# Altium project ESC.PrjPcb
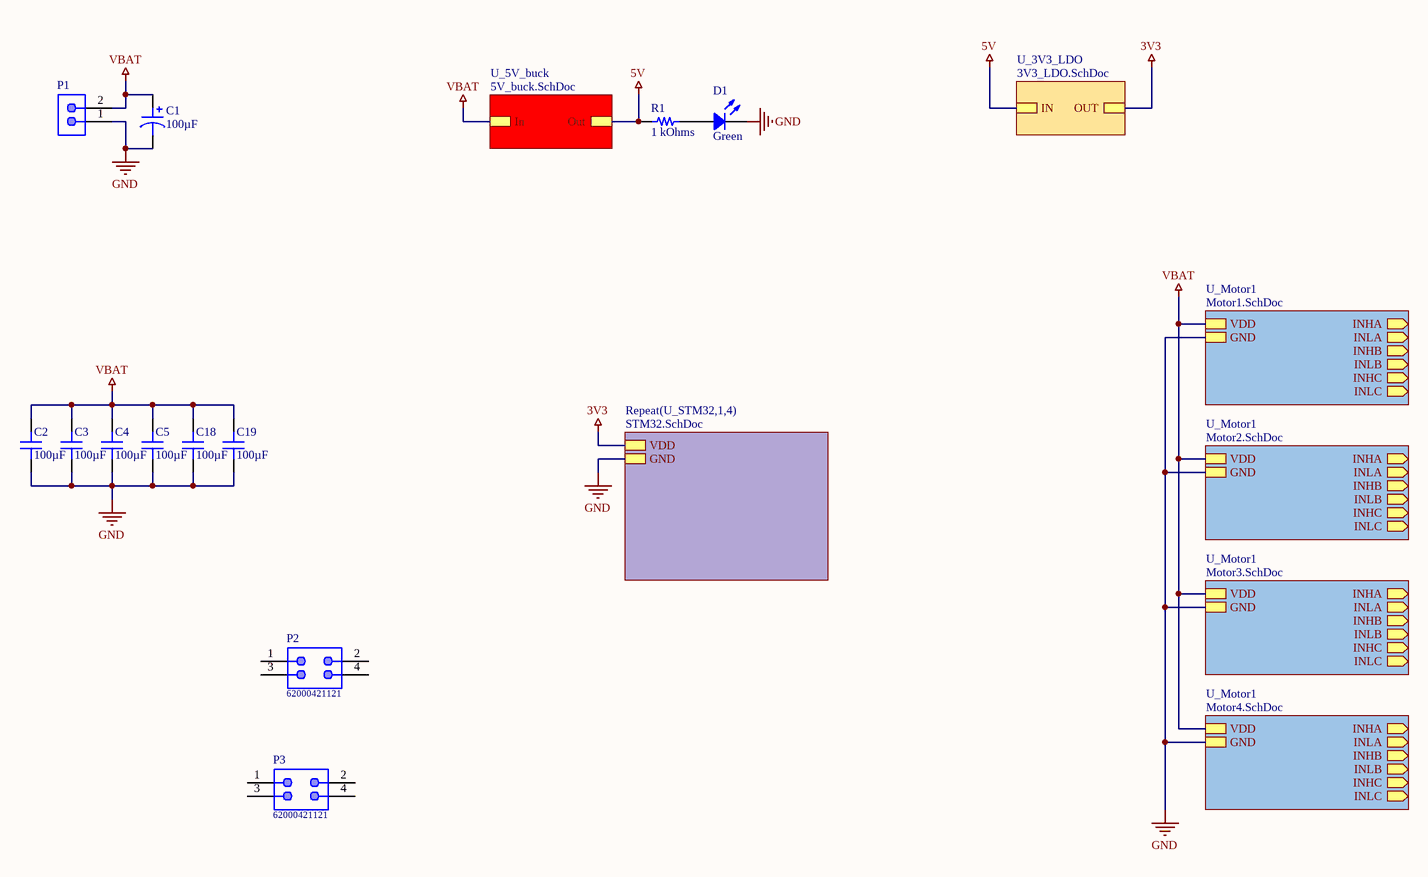
[diagram p0: Top.SchDoc]
8 sheets, 138 parts. Net scope: hierarchical (ports join the sheet entries above them; power ports are global).
Board file: ESC.PcbDoc
Sheets:
  Top.SchDoc
    U_5V_buck = 5V_buck.SchDoc
    U_3V3_LDO = 3V3_LDO.SchDoc
    U_Motor1 = Motor1.SchDoc
    U_Motor1 = Motor2.SchDoc
    U_Motor1 = Motor3.SchDoc
    U_Motor1 = Motor4.SchDoc
    U_STM321 = STM32.SchDoc
    U_STM322 = STM32.SchDoc
    U_STM323 = STM32.SchDoc
    U_STM324 = STM32.SchDoc

## Sheet Top.SchDoc
size B; SheetNumber: 1; SheetTotal: 8

### Parts
C1  100µF  [CAP POL 2917_7343]
C2  100µF  [CAP 1210_3225 - 2.8MM]
C3  100µF  [CAP 1210_3225 - 2.8MM]
C4  100µF  [CAP 1210_3225 - 2.8MM]
C5  100µF  [CAP 1210_3225 - 2.8MM]
C18  100µF  [CAP 1210_3225 - 2.8MM]
C19  100µF  [CAP 1210_3225 - 2.8MM]
D1  Green  [LED 0603_1608 GREEN]
P1  2 pin 2mm JST Male  [2pin - 2mm JST male]  (value not drawn)
P2  62000421121  [62000421121]
P3  62000421121  [62000421121]
R1  1 kOhms  [RES 0603_1608]

### Sub-sheets
Repeat(U_STM32,1,4) = STM32.SchDoc: VDD, GND
U_3V3_LDO = 3V3_LDO.SchDoc: OUT, IN
U_5V_buck = 5V_buck.SchDoc: Out, In
U_Motor1 = Motor1.SchDoc: VDD, GND, INHA (out), INLA (out), INHB (out), INLB (out), INHC (out), INLC (out)
U_Motor1 = Motor2.SchDoc: VDD, GND, INHA (out), INLA (out), INHB (out), INLB (out), INHC (out), INLC (out)
U_Motor1 = Motor3.SchDoc: VDD, GND, INHA (out), INLA (out), INHB (out), INLB (out), INHC (out), INLC (out)
U_Motor1 = Motor4.SchDoc: VDD, GND, INHA (out), INLA (out), INHB (out), INLB (out), INHC (out), INLC (out)

### Nets
3V3: sheet U_3V3_LDO/OUT, sheet Repeat(U_STM32,1,4)/VDD
5V: R1.1 ; sheet U_5V_buck/Out, sheet U_3V3_LDO/IN
GND: C1.2 C2.1 C3.1 C4.1 C5.1 C18.1 C19.1 D1.2 P1.1 ; sheet U_Motor1/GND, sheet U_Motor1/GND, sheet U_Motor1/GND, sheet U_Motor1/GND, sheet Repeat(U_STM32,1,4)/GND
VBAT: C1.1 C2.2 C3.2 C4.2 C5.2 C18.2 C19.2 P1.2 ; sheet U_5V_buck/In, sheet U_Motor1/VDD, sheet U_Motor1/VDD, sheet U_Motor1/VDD, sheet U_Motor1/VDD
NetD1_1: D1.1 R1.2

Not connected (* = marked no-connect by the designer): P2 1 2 3 4; P3 1 2 3 4

### Library data of the parts
C1 = 293D107X0020E2TE3: CAP TANT 100UF 20% 20V 2917; Manufacturer: Vishay Sprague; Manufacturer Size Code: E; ESR (Equivalent Series Resistance): 500mOhm; Type: Molded; Part Number: 293D107X0020E2TE3; Value: 100µF; Capacitance: 100µF; ComponentLink1Description: Datasheet; ComponentLink1URL: http://www.vishay.com/docs/40002/293d.pdf; ComponentLink2Description: DigiKey Link; ComponentLink2URL: http://digikey.com/product-detail/en/vishay-sprague/293D107X0020E2TE3/718-293D107X0020E2TE3CT-ND/10507022; Device Package: 2917 (7343 Metric); Features: General Purpose; Height - Seated (Max): 0.170" (4.32mm); LastUpdated: 13-Aug-20 10:43:35 AM; Lifecycle Status: Active; Minimum Order: 1; Mounting Type: Surface Mount; Operating Temperature: -55°C ~ 125°C; Package / Case: 2917 (7343 Metric); Packaging: TapeAndReel; PartId: 1360; Part Status: Active; Price: 0.70; Series: TANTAMOUNT®, 293D; Size / Dimension: 0.287" L x 0.169" W (7.30mm x 4.30mm); Supplier 1: DigiKey; Supplier Part Number 1: 718-293D107X0020E2TE3CT-ND; Tolerance: ±20%
C2-C5 C18 C19 = 12106D107MAT4A: CAP CER 100UF 6.3V X5R 1210; manufacturer: AVX Corporation; Tolerance: ±20%; Part Number: 12106D107MAT4A; Value: 100µF; Applications: General Purpose; Capacitance: 100µF; componentlink1description: Datasheet; componentlink1url: http://datasheets.avx.com/cx5r.pdf; componentlink2description: DigiKey Link; componentlink2url: http://digikey.com/product-detail/en/avx-corporation/12106D107MAT4A/478-11528-1-ND/8107729; Device Package: 1210 (3225 Metric); lastupdated: 9/2/2020 1:10:51 AM; Lifecycle Status: Active; Minimum Order: 1; Mounting Type: Surface Mount, MLCC; Operating Temperature: -55°C ~ 85°C; Package / Case: 1210 (3225 Metric); packaging: TapeAndReel; partid: 23954; Part Status: Active; price: 0.33; series: -; Size / Dimension: 0.126" L x 0.098" W (3.20mm x 2.50mm); Supplier 1: DigiKey; Supplier Part Number 1: 478-11528-1-ND; Temperature Coefficient: X5R; Thickness (Max): 0.110" (2.79mm); Voltage - Rated: 6.3V
D1 = XZCDGK53W-8VF: 1.6X0.8MM LC GREEN PIXSOLED DOME; Manufacturer: SunLED; Configuration: Independent; Current - Test: 2mA; Lens Color: Colorless; Lens Size: 0.35mm Dia; Lens Style: Round with Domed Top; Lens Transparency: Clear; Millicandela Rating: 417mcd; Viewing Angle: 60°; Voltage - Forward (Vf) (Typ): 2.65V; Wavelength - Dominant: 525nm; Wavelength - Peak: 515nm; Part Number: XZCDGK53W-8VF; Color: Green; ComponentLink1Description: Datasheet; ComponentLink1URL: https://www.sunledusa.com/products/spec/XZCDGK53W-8VF.pdf; ComponentLink2Description: DigiKey Link; ComponentLink2URL: http://digikey.com/product-detail/en/sunled/XZCDGK53W-8VF/1497-XZCDGK53W-8VFCT-ND/10449792; Device Package: 0603 (1608 Metric); Height (Max): 1.10mm; LastUpdated: 21-Jan-20 3:12:09 AM; Lifecycle Status: Active; Minimum Order: 1; Mounting Type: Surface Mount; Package / Case: 0603 (1608 Metric); Packaging: Unknown; PartId: 938; Part Status: Active; Price: 0.18; Series: Ultra Low Current; Size / Dimension: 1.60mm L x 0.80mm W; Supplier 1: DigiKey; Supplier Part Number 1: 1497-XZCDGK53W-8VFCT-ND; Supplier Device Package: 2-SMD; Value: Green
P2 P3 = 62000421121: WR-PHD Pin Header, THT, pitch 2mm, Dual Row, Vertical, 4p; Manufacturer: Wurth Elektronik; Pin Number: 4; Rated Current: 2A; Working Voltage: 200VAC; Withstanding Voltage: 500VAC; Contact Resistance: 20mOhm; ComponentLink1Description: Manufacturer; ComponentLink1URL: http://www.we-online.de; ComponentLink2Description: Datasheet; ComponentLink2URL: https://www.we-online.com/catalog/datasheet/62000421121.pdf; Operating Temperature: -40 to +105degC; Published Date: May 2020; Pitch: 2mm; Manufacturer Part Number: 62000421121; Mounting Technology: THT; Packaging: Bag; Gender: Pin Header; Row Number: Dual; Orientation: Vertical
R1 = RNCF0603DTE1K00: RES 1K OHM 0.5% 1/10W 0603; Manufacturer: Stackpole Electronics Inc; Power (Watts): 0.1W, 1/10W; Temperature Coefficient: ±25ppm/°C; Part Number: RNCF0603DTE1K00; Value: 1 kOhms; ComponentLink1Description: Datasheet; ComponentLink1URL: https://www.seielect.com/catalog/sei-rncf.pdf; ComponentLink2Description: DigiKey Link; ComponentLink2URL: http://digikey.com/product-detail/en/stackpole-electronics-inc/RNCF0603DTE1K00/RNCF0603DTE1K00CT-ND/9915086; Composition: Thin Film; Device Package: 0603 (1608 Metric); Features: Automotive AEC-Q200; Height - Seated (Max): 0.022" (0.55mm); LastUpdated: 21-Jan-20 12:14:28 AM; Lifecycle Status: Active; Minimum Order: 1; Number of Terminations: 2; Operating Temperature: -55°C ~ 155°C; Package / Case: 0603 (1608 Metric); Packaging: TapeAndReel; PartId: 26300; Part Status: Active; Price: 0.05; Ratings: AEC-Q200; Resistance: 1 kOhms; Series: RNCF; Size / Dimension: 0.061" L x 0.031" W (1.55mm x 0.80mm); Supplier 1: DigiKey; Supplier Part Number 1: RNCF0603DTE1K00CT-ND; Supplier Device Package: 0603; Tolerance: ±0.5%

## Sheet 5V_buck.SchDoc
size A; SheetNumber: 3; SheetTotal: 7
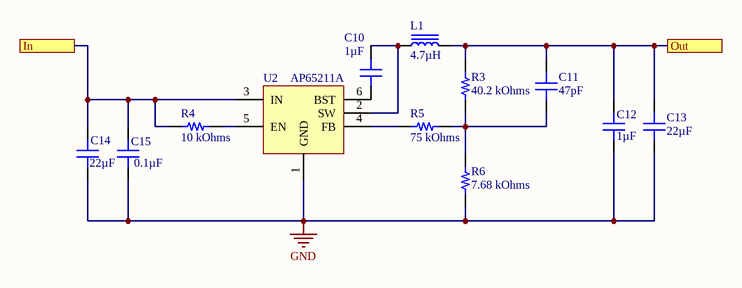
[diagram p1: 5V_buck.SchDoc]

### Parts
C10  1µF  [CAP 0603_1608]
C11  47pF  [CAP 0603_1608]
C12  1µF  [CAP 0603_1608]
C13  22µF  [CAP 0805_2012]
C14  22µF  [CAP 0805_2012]
C15  0.1µF  [CAP 0603_1608]
L1  4.7µH  [IND 1008_2520]
R3  40.2 kOhms  [RES 0603_1608]
R4  10 kOhms  [RES 0603_1608]
R5  75 kOhms  [RES 0603_1608]
R6  7.68 kOhms  [RES 0603_1608]
U2  AP65211A  [TSOT-26-6]

### Ports
In, Out

### Nets
5V: C11.2 C12.2 C13.2 L1.2 R3.2 ; port Out
GND: C12.1 C13.1 C14.1 C15.2 R6.1 U2.1(GND)
VBAT: C14.2 C15.1 R4.2 U2.3(IN) ; port In
NetC10_1: C10.1 L1.1 U2.2(SW)
NetC10_2: C10.2 U2.6(BST)
NetC11_1: C11.1 R3.1 R5.2 R6.2
NetR4_1: R4.1 U2.5(EN)
NetR5_1: R5.1 U2.4(FB)

### Library data of the parts
C10 C12 = GCJ188R71E105KA01D: CAP CER 1UF 25V X7R 0603; Manufacturer: Murata Electronics; Tolerance: ±10%; Part Number: GCJ188R71E105KA01D; Value: 1µF; Applications: Automotive, Boardflex Sensitive; Capacitance: 1µF; ComponentLink1Description: Datasheet; ComponentLink1URL: https://search.murata.co.jp/Ceramy/image/img/A01X/G101/ENG/GCJ188R71E105KA01-01.pdf; ComponentLink2Description: DigiKey Link; ComponentLink2URL: http://digikey.com/product-detail/en/murata-electronics/GCJ188R71E105KA01D/490-14409-1-ND/6606870; Device Package: 0603 (1608 Metric); Features: Soft Termination; LastUpdated: 13-Aug-20 10:24:06 AM; Lifecycle Status: Active; Minimum Order: 1; Mounting Type: Surface Mount, MLCC; Operating Temperature: -55°C ~ 125°C; Package / Case: 0603 (1608 Metric); Packaging: TapeAndReel; PartId: 9566; Part Status: Active; Price: 0.05; Ratings: AEC-Q200; Series: GCJ; Size / Dimension: 0.063" L x 0.031" W (1.60mm x 0.80mm); Supplier 1: DigiKey; Supplier Part Number 1: 490-14409-1-ND; Temperature Coefficient: X7R; Thickness (Max): 0.035" (0.90mm)
C11 = C1608NP02A470J080AA: CAP CER 47PF 100V NP0 0603; Manufacturer: TDK Corporation; Temperature Coefficient: C0G, NP0; Tolerance: ±5%; Part Number: C1608NP02A470J080AA; Value: 47pF; Applications: General Purpose; Capacitance: 47pF; ComponentLink1Description: Datasheet; ComponentLink1URL: https://product.tdk.com/info/en/catalog/datasheets/mlcc_commercial_hightemp_en.pdf?ref_disty=digikey; ComponentLink2Description: DigiKey Link; ComponentLink2URL: http://digikey.com/product-detail/en/tdk-corporation/C1608NP02A470J080AA/445-14125-1-ND/3955791; Device Package: 0603 (1608 Metric); Features: High Temperature; LastUpdated: 13-Aug-20 10:25:18 AM; Lifecycle Status: Active; Minimum Order: 1; Mounting Type: Surface Mount, MLCC; Operating Temperature: -55°C ~ 150°C; Package / Case: 0603 (1608 Metric); Packaging: TapeAndReel; PartId: 7049; Part Status: Active; Price: 0.04; Series: C; Size / Dimension: 0.063" L x 0.031" W (1.60mm x 0.80mm); Supplier 1: DigiKey; Supplier Part Number 1: 445-14125-1-ND; Thickness (Max): 0.035" (0.90mm)
C13 = CL21A226MOQNNNE: CAP CER 22UF 16V X5R 0805; Manufacturer: Samsung Electro-Mechanics; Tolerance: ±20%; Part Number: CL21A226MOQNNNE; Value: 22µF; Applications: General Purpose; Capacitance: 22µF; ComponentLink1Description: Datasheet; ComponentLink1URL: http://www.samsungsem.com/kr/support/product-search/mlcc/CL21A226MOQNNNE.jsp; ComponentLink2Description: DigiKey Link; ComponentLink2URL: http://digikey.com/product-detail/en/samsung-electro-mechanics/CL21A226MOQNNNE/1276-2909-1-ND/3890995; Device Package: 0805 (2012 Metric); LastUpdated: 21-Jan-20 12:03:05 AM; Lifecycle Status: Active; Minimum Order: 1; Mounting Type: Surface Mount, MLCC; Operating Temperature: -55°C ~ 85°C; Package / Case: 0805 (2012 Metric); Packaging: TapeAndReel; PartId: 3052; Part Status: Active; Price: 0.11; Series: CL; Size / Dimension: 0.079" L x 0.049" W (2.00mm x 1.25mm); Supplier 1: DigiKey; Supplier Part Number 1: 1276-2909-1-ND; Temperature Coefficient: X5R; Thickness (Max): 0.055" (1.40mm); Voltage - Rated: 16V
C14 = C2012X7S1E106K125AC: CAP CER 10UF 25V X7S 0805; Manufacturer: TDK Corporation; Capacitance: 10µF; Tolerance: ±10%; Part Number: C2012X7S1E106K125AC; Value: 22µF; Applications: General Purpose; ComponentLink1Description: Datasheet; ComponentLink1URL: https://product.tdk.com/en/search/capacitor/ceramic/mlcc/info?part_no=C2012X7S1E106K125AC?ref_disty=digikey; ComponentLink2Description: DigiKey Link; ComponentLink2URL: http://digikey.com/product-detail/en/tdk-corporation/C2012X7S1E106K125AC/445-181600-1-ND/9991478; Device Package: 0805 (2012 Metric); Features: Low ESL; LastUpdated: 21-Jan-20 12:03:04 AM; Lifecycle Status: Active; Minimum Order: 1; Mounting Type: Surface Mount, MLCC; Operating Temperature: -55°C ~ 125°C; Package / Case: 0805 (2012 Metric); Packaging: TapeAndReel; PartId: 3339; Part Status: Active; Price: 0.15; Series: C; Size / Dimension: 0.079" L x 0.049" W (2.00mm x 1.25mm); Supplier 1: DigiKey; Supplier Part Number 1: 445-181600-1-ND; Temperature Coefficient: X7S; Thickness (Max): 0.057" (1.45mm); Voltage - Rated: 25V
C15 = GCG188R92A104KA03D: CAP CER 0.1UF 100V 0603 EPOXY; Manufacturer: Murata Electronics; Temperature Coefficient: X8R; Tolerance: ±10%; Part Number: GCG188R92A104KA03D; Value: 0.1µF; Applications: Automotive; Capacitance: 0.1µF; ComponentLink1Description: Datasheet; ComponentLink1URL: https://search.murata.co.jp/Ceramy/image/img/A01X/G101/ENG/GCG188R92A104KA03-01.pdf; ComponentLink2Description: DigiKey Link; ComponentLink2URL: http://digikey.com/product-detail/en/murata-electronics/GCG188R92A104KA03D/490-18197-1-ND/9867926; Device Package: 0603 (1608 Metric); Features: Epoxy Mountable; LastUpdated: 21-Jan-20 12:01:59 AM; Lifecycle Status: Active; Minimum Order: 1; Mounting Type: Surface Mount, MLCC, Epoxy; Operating Temperature: -55°C ~ 150°C; Package / Case: 0603 (1608 Metric); Packaging: TapeAndReel; PartId: 9025; Part Status: Active; Price: 0.07; Ratings: AEC-Q200; Series: GCG; Size / Dimension: 0.063" L x 0.031" W (1.60mm x 0.80mm); Supplier 1: DigiKey; Supplier Part Number 1: 490-18197-1-ND; Thickness (Max): 0.035" (0.90mm); Voltage - Rated: 100V
L1 = MLP2520S4R7ST0S1: FIXED IND 4.7UH 1A 110 MOHM SMD; Manufacturer: TDK Corporation; DC Resistance (DCR): 143mOhm Max; Inductance Frequency - Test: 2MHz; Material - Core: Ferrite; Shielding: Shielded; Tolerance: ±20%; Type: Multilayer; Part Number: MLP2520S4R7ST0S1; ComponentLink1Description: Datasheet; ComponentLink1URL: https://product.tdk.com/info/en/catalog/datasheets/inductor_commercial_power_mlp2520_en.pdf?ref_disty=digikey; ComponentLink2Description: DigiKey Link; ComponentLink2URL: http://digikey.com/product-detail/en/tdk-corporation/MLP2520S4R7ST0S1/445-6378-1-ND/2465705; Current Rating (Amps): 1A; Device Package: 1008 (2520 Metric); Height - Seated (Max): 0.039" (1.00mm); Inductance: 4.7µH; LastUpdated: 13-Aug-20 11:03:40 AM; Lifecycle Status: Active; Minimum Order: 1; Mounting Type: Surface Mount; Operating Temperature: -40°C ~ 125°C; Package / Case: 1008 (2520 Metric); Packaging: TapeAndReel; PartId: 3467; Part Status: Active; Price: 0.14; Series: MLP; Size / Dimension: 0.098" L x 0.079" W (2.50mm x 2.00mm); Supplier 1: DigiKey; Supplier Part Number 1: 445-6378-1-ND; Supplier Device Package: 1008 (2520 Metric); Value: 4.7µH
R3 = RT0603DRD0740K2L: RES SMD 40.2KOHM 0.5% 1/10W 0603; Manufacturer: Yageo; Power (Watts): 0.1W, 1/10W; Temperature Coefficient: ±25ppm/°C; Part Number: RT0603DRD0740K2L; Value: 40.2 kOhms; ComponentLink1Description: Datasheet; ComponentLink1URL: https://www.yageo.com/upload/media/product/productsearch/datasheet/rchip/PYu-RT_1-to-0.01_RoHS_L_11.pdf; ComponentLink2Description: DigiKey Link; ComponentLink2URL: http://digikey.com/product-detail/en/yageo/RT0603DRD0740K2L/311-40.2KDCT-ND/1035817; Composition: Thin Film; Device Package: 0603 (1608 Metric); Height - Seated (Max): 0.022" (0.55mm); LastUpdated: 13-Aug-20 10:36:48 AM; Lifecycle Status: Active; Minimum Order: 1; Number of Terminations: 2; Operating Temperature: -55°C ~ 155°C; Package / Case: 0603 (1608 Metric); Packaging: TapeAndReel; PartId: 18076; Part Status: Active; Price: 0.02; Resistance: 40.2 kOhms; Series: RT; Size / Dimension: 0.063" L x 0.031" W (1.60mm x 0.80mm); Supplier 1: DigiKey; Supplier Part Number 1: 311-40.2KDCT-ND; Supplier Device Package: 0603; Tolerance: ±0.5%
R4 = RNCS0603BKE10K0: RES 10K OHM 0.1% 1/16W 0603; Manufacturer: Stackpole Electronics Inc; Power (Watts): 0.063W, 1/16W; Temperature Coefficient: ±25ppm/°C; Part Number: RNCS0603BKE10K0; Value: 10 kOhms; ComponentLink1Description: Datasheet; ComponentLink1URL: https://www.seielect.com/catalog/sei-rncs_rnch.pdf; ComponentLink2Description: DigiKey Link; ComponentLink2URL: http://digikey.com/product-detail/en/stackpole-electronics-inc/RNCS0603BKE10K0/RNCS0603BKE10K0CT-ND/1800113; Composition: Thin Film; Device Package: 0603 (1608 Metric); Features: Anti-Corrosive, Automotive AEC-Q200, Moisture Resistant; Height - Seated (Max): 0.022" (0.55mm); LastUpdated: 21-Jan-20 12:25:01 AM; Lifecycle Status: Active; Minimum Order: 1; Number of Terminations: 2; Operating Temperature: -55°C ~ 155°C; Package / Case: 0603 (1608 Metric); Packaging: TapeAndReel; PartId: 4838; Part Status: Active; Price: 0.08; Ratings: AEC-Q200; Resistance: 10 kOhms; Series: RNCS; Size / Dimension: 0.061" L x 0.031" W (1.55mm x 0.80mm); Supplier 1: DigiKey; Supplier Part Number 1: RNCS0603BKE10K0CT-ND; Supplier Device Package: 0603; Tolerance: ±0.1%
R5 = CR0603-JW-753ELF: RES SMD 75K OHM 5% 1/10W 0603; Manufacturer: Bourns Inc.; Power (Watts): 0.1W, 1/10W; Temperature Coefficient: ±200ppm/°C; Part Number: CR0603-JW-753ELF; Value: 75 kOhms; ComponentLink1Description: Datasheet; ComponentLink1URL: https://www.bourns.com/docs/Product-Datasheets/CHPREZTR.pdf; ComponentLink2Description: DigiKey Link; ComponentLink2URL: http://digikey.com/product-detail/en/bourns-inc/CR0603-JW-753ELF/CR0603-JW-753ELFCT-ND/4247893; Composition: Thick Film; Device Package: 0603 (1608 Metric); Features: Moisture Resistant; Height - Seated (Max): 0.022" (0.55mm); LastUpdated: 13-Aug-20 10:36:37 AM; Lifecycle Status: Active; Minimum Order: 1; Number of Terminations: 2; Operating Temperature: -55°C ~ 155°C; Package / Case: 0603 (1608 Metric); Packaging: CutTape; PartId: 23428; Part Status: Active; Price: 0.10; Resistance: 75 kOhms; Series: CR0603; Size / Dimension: 0.063" L x 0.031" W (1.60mm x 0.80mm); Supplier 1: DigiKey; Supplier Part Number 1: CR0603-JW-753ELFCT-ND; Supplier Device Package: 0603; Tolerance: ±5%
R6 = RMCF0603FT7K68: RES 7.68K OHM 1% 1/10W 0603; Manufacturer: Stackpole Electronics Inc; Power (Watts): 0.1W, 1/10W; Temperature Coefficient: ±100ppm/°C; Part Number: RMCF0603FT7K68; Value: 7.68 kOhms; ComponentLink1Description: Datasheet; ComponentLink1URL: https://www.seielect.com/catalog/sei-rmcf_rmcp.pdf; ComponentLink2Description: DigiKey Link; ComponentLink2URL: http://digikey.com/product-detail/en/stackpole-electronics-inc/RMCF0603FT7K68/RMCF0603FT7K68CT-ND/4425120; Composition: Thick Film; Device Package: 0603 (1608 Metric); Features: Automotive AEC-Q200; Height - Seated (Max): 0.022" (0.55mm); LastUpdated: 13-Aug-20 10:36:44 AM; Lifecycle Status: Active; Minimum Order: 1; Number of Terminations: 2; Operating Temperature: -55°C ~ 155°C; Package / Case: 0603 (1608 Metric); Packaging: CutTape; PartId: 20370; Part Status: Active; Price: 0.10; Ratings: AEC-Q200; Resistance: 7.68 kOhms; Series: RMCF; Size / Dimension: 0.061" L x 0.031" W (1.55mm x 0.80mm); Supplier 1: DigiKey; Supplier Part Number 1: RMCF0603FT7K68CT-ND; Supplier Device Package: 0603; Tolerance: ±1%
U2 = AP65211A: ADJ step down Buck

## Sheet 3V3_LDO.SchDoc
size A; SheetNumber: 2; SheetTotal: 7
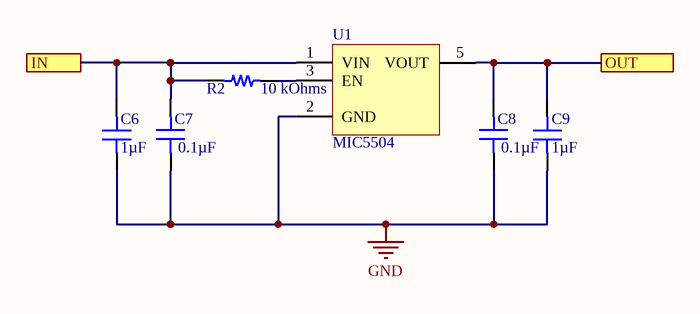
[diagram p2: 3V3_LDO.SchDoc]

### Parts
C6  1µF  [CAP 0603_1608]
C7  0.1µF  [CAP 0603_1608]
C8  0.1µF  [CAP 0603_1608]
C9  1µF  [CAP 0603_1608]
R2  10 kOhms  [RES 0603_1608]
U1  MIC5504  [TI SOT-23-5 DBV]

### Ports
IN, OUT

### Nets
3V3: C8.1 C9.2 U1.5(VOUT) ; port OUT
5V: C6.2 C7.1 R2.2 U1.1(VIN) ; port IN
GND: C6.1 C7.2 C8.2 C9.1 U1.2(GND)
NetR2_1: R2.1 U1.3(EN)

### Library data of the parts
C6 C9 = GCJ188R71E105KA01D: as C10 on sheet 5V_buck; Part Number: GCJ188R71E105KA01D; Value: 1µF; Applications: Automotive, Boardflex Sensitive; Capacitance: 1µF; ComponentLink1Description: Datasheet; ComponentLink1URL: https://search.murata.co.jp/Ceramy/image/img/A01X/G101/ENG/GCJ188R71E105KA01-01.pdf; ComponentLink2Description: DigiKey Link; ComponentLink2URL: http://digikey.com/product-detail/en/murata-electronics/GCJ188R71E105KA01D/490-14409-1-ND/6606870; Device Package: 0603 (1608 Metric); Features: Soft Termination; LastUpdated: 13-Aug-20 10:24:06 AM; Lifecycle Status: Active; Minimum Order: 1; Mounting Type: Surface Mount, MLCC; Operating Temperature: -55°C ~ 125°C; Package / Case: 0603 (1608 Metric); Packaging: TapeAndReel; PartId: 9566; Part Status: Active; Price: 0.05; Ratings: AEC-Q200; Series: GCJ; Size / Dimension: 0.063" L x 0.031" W (1.60mm x 0.80mm); Supplier 1: DigiKey; Supplier Part Number 1: 490-14409-1-ND; Temperature Coefficient: X7R; Thickness (Max): 0.035" (0.90mm)
C7 C8 = GCG188R92A104KA03D: as C15 on sheet 5V_buck; Part Number: GCG188R92A104KA03D; Value: 0.1µF; Applications: Automotive; Capacitance: 0.1µF; ComponentLink1Description: Datasheet; ComponentLink1URL: https://search.murata.co.jp/Ceramy/image/img/A01X/G101/ENG/GCG188R92A104KA03-01.pdf; ComponentLink2Description: DigiKey Link; ComponentLink2URL: http://digikey.com/product-detail/en/murata-electronics/GCG188R92A104KA03D/490-18197-1-ND/9867926; Device Package: 0603 (1608 Metric); Features: Epoxy Mountable; LastUpdated: 21-Jan-20 12:01:59 AM; Lifecycle Status: Active; Minimum Order: 1; Mounting Type: Surface Mount, MLCC, Epoxy; Operating Temperature: -55°C ~ 150°C; Package / Case: 0603 (1608 Metric); Packaging: TapeAndReel; PartId: 9025; Part Status: Active; Price: 0.07; Ratings: AEC-Q200; Series: GCG; Size / Dimension: 0.063" L x 0.031" W (1.60mm x 0.80mm); Supplier 1: DigiKey; Supplier Part Number 1: 490-18197-1-ND; Thickness (Max): 0.035" (0.90mm); Voltage - Rated: 100V
R2 = RNCS0603BKE10K0: as R4 on sheet 5V_buck; Part Number: RNCS0603BKE10K0; Value: 10 kOhms; ComponentLink1Description: Datasheet; ComponentLink1URL: https://www.seielect.com/catalog/sei-rncs_rnch.pdf; ComponentLink2Description: DigiKey Link; ComponentLink2URL: http://digikey.com/product-detail/en/stackpole-electronics-inc/RNCS0603BKE10K0/RNCS0603BKE10K0CT-ND/1800113; Composition: Thin Film; Device Package: 0603 (1608 Metric); Features: Anti-Corrosive, Automotive AEC-Q200, Moisture Resistant; Height - Seated (Max): 0.022" (0.55mm); LastUpdated: 21-Jan-20 12:25:01 AM; Lifecycle Status: Active; Minimum Order: 1; Number of Terminations: 2; Operating Temperature: -55°C ~ 155°C; Package / Case: 0603 (1608 Metric); Packaging: TapeAndReel; PartId: 4838; Part Status: Active; Price: 0.08; Ratings: AEC-Q200; Resistance: 10 kOhms; Series: RNCS; Size / Dimension: 0.061" L x 0.031" W (1.55mm x 0.80mm); Supplier 1: DigiKey; Supplier Part Number 1: RNCS0603BKE10K0CT-ND; Supplier Device Package: 0603; Tolerance: ±0.1%
U1 = MIC5504-3.3YM5: 3.3V LDO

## Sheet Motor1.SchDoc
size A; SheetNumber: 4; SheetTotal: 8
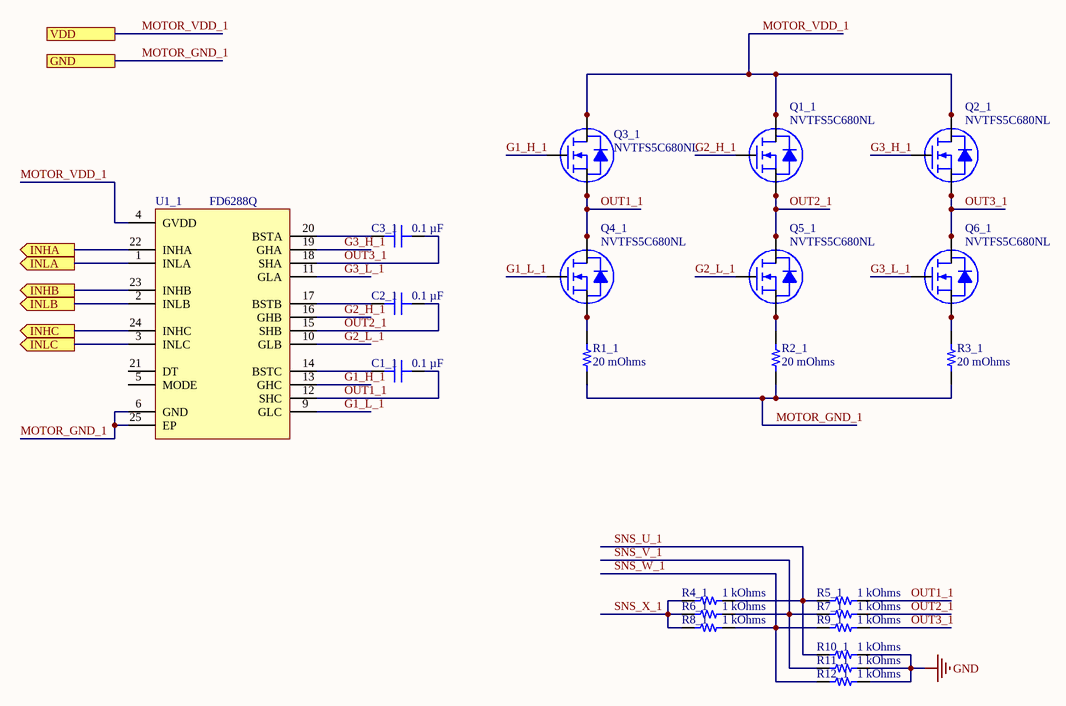
[diagram p3: Motor1.SchDoc]

### Parts
C1_1  0.1 µF  [CAP 0402_1005]
C2_1  0.1 µF  [CAP 0402_1005]
C3_1  0.1 µF  [CAP 0402_1005]
Q1_1  NVTFS5C680NL  [NVTFS015N04CTAG]
Q2_1  NVTFS5C680NL  [NVTFS015N04CTAG]
Q3_1  NVTFS5C680NL  [NVTFS015N04CTAG]
Q4_1  NVTFS5C680NL  [NVTFS015N04CTAG]
Q5_1  NVTFS5C680NL  [NVTFS015N04CTAG]
Q6_1  NVTFS5C680NL  [NVTFS015N04CTAG]
R1_1  20 mOhms  [STACKPOLE CSR0805]
R2_1  20 mOhms  [STACKPOLE CSR0805]
R3_1  20 mOhms  [STACKPOLE CSR0805]
R4_1  1 kOhms  [RES 0402_1005]
R5_1  1 kOhms  [RES 0402_1005]
R6_1  1 kOhms  [RES 0402_1005]
R7_1  1 kOhms  [RES 0402_1005]
R8_1  1 kOhms  [RES 0402_1005]
R9_1  1 kOhms  [RES 0402_1005]
R10_1  1 kOhms  [RES 0402_1005]
R11_1  1 kOhms  [RES 0402_1005]
R12_1  1 kOhms  [RES 0402_1005]
U1_1  FD6288Q  [QFN50P400X400X100-25N]

### Ports
GND, INHA (out), INHB (out), INHC (out), INLA (out), INLB (out), INLC (out), VDD

### Nets
GND: R1_1.1 R2_1.1 R3_1.1 R10_1.1 R11_1.1 R12_1.1 U1_1.6(GND) U1_1.25(EP) ; port GND  [also labelled MOTOR_GND_1]
MOTOR_VDD_1: Q1_1.5(D) Q1_1.6(D) Q1_1.7(D) Q1_1.8(D) Q2_1.5(D) Q2_1.6(D) Q2_1.7(D) Q2_1.8(D) Q3_1.5(D) Q3_1.6(D) Q3_1.7(D) Q3_1.8(D) U1_1.4(GVDD) ; port VDD  [project net VBAT]
G1_H_1: Q3_1.4(G) U1_1.13(GHC)
G1_L_1: Q4_1.4(G) U1_1.9(GLC)
G2_H_1: Q1_1.4(G) U1_1.16(GHB)
G2_L_1: Q5_1.4(G) U1_1.10(GLB)
G3_H_1: Q2_1.4(G) U1_1.19(GHA)
G3_L_1: Q6_1.4(G) U1_1.11(GLA)
OUT1_1: C1_1.2 Q3_1.1(S) Q3_1.2(S) Q3_1.3(S) Q4_1.5(D) Q4_1.6(D) Q4_1.7(D) Q4_1.8(D) R5_1.2 U1_1.12(SHC)
OUT2_1: C2_1.2 Q1_1.1(S) Q1_1.2(S) Q1_1.3(S) Q5_1.5(D) Q5_1.6(D) Q5_1.7(D) Q5_1.8(D) R7_1.2 U1_1.15(SHB)
OUT3_1: C3_1.2 Q2_1.1(S) Q2_1.2(S) Q2_1.3(S) Q6_1.5(D) Q6_1.6(D) Q6_1.7(D) Q6_1.8(D) R9_1.2 U1_1.18(SHA)
SNS_U_1: R4_1.2 R5_1.1 R10_1.2
SNS_V_1: R6_1.2 R7_1.1 R11_1.2
SNS_W_1: R8_1.2 R9_1.1 R12_1.2
SNS_X_1: R4_1.1 R6_1.1 R8_1.1
NetC1_1_1: C1_1.1 U1_1.14(BSTC)
NetC2_1_1: C2_1.1 U1_1.17(BSTB)
NetC3_1_1: C3_1.1 U1_1.20(BSTA)
NetQ4_1_1: Q4_1.1(S) Q4_1.2(S) Q4_1.3(S) R1_1.2
NetQ5_1_1: Q5_1.1(S) Q5_1.2(S) Q5_1.3(S) R2_1.2
NetQ6_1_1: Q6_1.1(S) Q6_1.2(S) Q6_1.3(S) R3_1.2
NetU1_1_1: U1_1.1(INLA) ; port INLA
NetU1_1_2: U1_1.2(INLB) ; port INLB
NetU1_1_3: U1_1.3(INLC) ; port INLC
NetU1_1_22: U1_1.22(INHA) ; port INHA
NetU1_1_23: U1_1.23(INHB) ; port INHB
NetU1_1_24: U1_1.24(INHC) ; port INHC

Not connected (* = marked no-connect by the designer): U1_1 5(MODE) 21(DT)

### Library data of the parts
C1_1 C2_1 C3_1 = C0402C104K4RACAUTO: CAP CER 0.1UF 16V X7R 0402; manufacturer: KEMET; Tolerance: ±10%; Part Number: C0402C104K4RACAUTO; Value: 0.1 µF; Applications: Automotive, Bypass, Decoupling; Capacitance: 0.1 µF; componentlink1description: Datasheet; componentlink1url: https://api.kemet.com/component-edge/download/specsheet/C0402C104K4RACAUTO.pdf; componentlink2description: DigiKey Link; componentlink2url: https://www.digikey.com/en/products/detail/kemet/C0402C104K4RACAUTO/3314827; Device Package: 0402 (1005 Metric); lastupdated: 8/14/2022 9:05:51 PM; Lifecycle Status: Active; Minimum Order: 1; Mounting Type: Surface Mount, MLCC; Operating Temperature: -55°C ~ 125°C; Package / Case: 0402 (1005 Metric); packaging: TapeAndReel; partid: 3024; Part Status: Active; price: 0.01; Ratings: AEC-Q200; series: SMD Auto X7R; Size / Dimension: 0.039" L x 0.020" W (1.00mm x 0.50mm); Supplier 1: DigiKey; Supplier Part Number 1: 399-6828-1-ND; Temperature Coefficient: X7R; Thickness (Max): 0.022" (0.55mm); Voltage - Rated: 16V
Q1_1 Q2_1 Q3_1 Q4_1 Q5_1 Q6_1 = NVTFS5C680NL: N-FET
R1_1 R2_1 R3_1 = ERJ-3BWFR020V: RES 0.02 OHM 1% 1/3W 0603; Manufacturer: Panasonic Electronic Components; Power (Watts): 0.333W, 1/3W; Temperature Coefficient: ±250ppm/°C; Part Number: ERJ-3BWFR020V; Package / Case: 0603 (1608 Metric); ComponentLink1Description: Datasheet; ComponentLink1URL: https://industrial.panasonic.com/cdbs/www-data/pdf/RDN0000/AOA0000C313.pdf; ComponentLink2Description: DigiKey Link; ComponentLink2URL: https://www.digikey.com/en/products/detail/panasonic-electronic-components/ERJ-3BWFR020V/5647494; Composition: Thick Film; Device Package: 0603 (1608 Metric); Features: Automotive AEC-Q200, Current Sense; Height - Seated (Max): 0.026" (0.65mm); LastUpdated: 8/14/2022 9:50:04 PM; Lifecycle Status: Active; Minimum Order: 1; Number of Terminations: 2; Operating Temperature: -55°C ~ 155°C; Packaging: TapeAndReel; PartId: 64; Part Status: Active; Price: 0.06; Ratings: AEC-Q200; Resistance: 20 mOhms; Series: ERJ-3BW; Size / Dimension: 0.063" L x 0.031" W (1.60mm x 0.80mm); Supplier 1: DigiKey; Supplier Part Number 1: P17461CT-ND; Supplier Device Package: 0603; Tolerance: ±1%; Value: 20 mOhms
R4_1 R5_1 R6_1 R7_1 R8_1 R9_1 R10_1 R11_1 R12_1 = RK73H1ETTP1432F: RES 14.3K OHM 1% 1/10W 0402; Manufacturer: KOA Speer Electronics, Inc.; Power (Watts): 0.1W, 1/10W; Resistance: 14.3 kOhms; Temperature Coefficient: ±100ppm/°C; Part Number: RK73H1ETTP1432F; Value: 1 kOhms; ComponentLink1Description: Datasheet; ComponentLink1URL: http://www.koaspeer.com/catimages/Products/RK73H/RK73H.pdf; ComponentLink2Description: DigiKey Link; ComponentLink2URL: https://www.digikey.com/en/products/detail/koa-speer-electronics-inc/RK73H1ETTP1432F/9844351; Composition: Thick Film; Device Package: 0402 (1005 Metric); Features: Automotive AEC-Q200, Moisture Resistant; Height - Seated (Max): 0.016" (0.40mm); LastUpdated: 8/14/2022 9:23:49 PM; Lifecycle Status: Active; Minimum Order: 1; Number of Terminations: 2; Operating Temperature: -55°C ~ 155°C; Package / Case: 0402 (1005 Metric); Packaging: CutTape; PartId: 10193; Part Status: Active; Price: 0.01; Ratings: AEC-Q200; Series: RK73H; Size / Dimension: 0.039" L x 0.020" W (1.00mm x 0.50mm); Supplier 1: DigiKey; Supplier Part Number 1: 2019-RK73H1ETTP1432FCT-ND; Supplier Device Package: 0402; Tolerance: ±1%
U1_1 = FD6288Q: 3 Phase Gate Driver 1.5-2.2A; MF: Texas Instruments; MP: UCC27282DRCR; Texas_Instruments-Purchase-URL: https://snapeda.com/shop?store=Texas+Instruments&id=3625400; Price: None; Availability: Warning; Package: VSON-10 Texas Instruments; SnapEDA_Link: https://www.snapeda.com/parts/UCC27282DRCR/Texas%20Instruments/view-part/3625400/?ref=snap; DigiKey-Purchase-URL: https://snapeda.com/shop?store=DigiKey&id=3625400; Value: *

## Sheet Motor2.SchDoc
size A; SheetNumber: 5; SheetTotal: 7
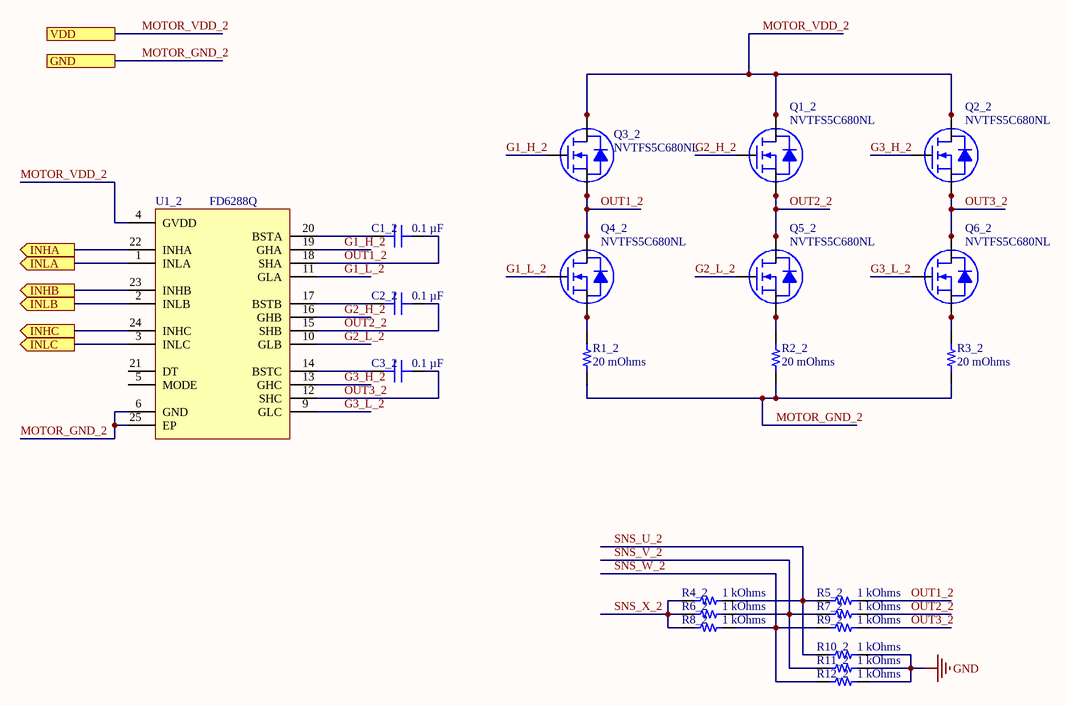
[diagram p4: Motor2.SchDoc]

### Parts
C1_2  0.1 µF  [CAP 0402_1005]
C2_2  0.1 µF  [CAP 0402_1005]
C3_2  0.1 µF  [CAP 0402_1005]
Q1_2  NVTFS5C680NL  [NVTFS015N04CTAG]
Q2_2  NVTFS5C680NL  [NVTFS015N04CTAG]
Q3_2  NVTFS5C680NL  [NVTFS015N04CTAG]
Q4_2  NVTFS5C680NL  [NVTFS015N04CTAG]
Q5_2  NVTFS5C680NL  [NVTFS015N04CTAG]
Q6_2  NVTFS5C680NL  [NVTFS015N04CTAG]
R1_2  20 mOhms  [STACKPOLE CSR0805]
R2_2  20 mOhms  [STACKPOLE CSR0805]
R3_2  20 mOhms  [STACKPOLE CSR0805]
R4_2  1 kOhms  [RES 0402_1005]
R5_2  1 kOhms  [RES 0402_1005]
R6_2  1 kOhms  [RES 0402_1005]
R7_2  1 kOhms  [RES 0402_1005]
R8_2  1 kOhms  [RES 0402_1005]
R9_2  1 kOhms  [RES 0402_1005]
R10_2  1 kOhms  [RES 0402_1005]
R11_2  1 kOhms  [RES 0402_1005]
R12_2  1 kOhms  [RES 0402_1005]
U1_2  FD6288Q  [QFN50P400X400X100-25N]

### Ports
GND, INHA (out), INHB (out), INHC (out), INLA (out), INLB (out), INLC (out), VDD

### Nets
GND: R1_2.1 R2_2.1 R3_2.1 R10_2.1 R11_2.1 R12_2.1 U1_2.6(GND) U1_2.25(EP) ; port GND  [also labelled MOTOR_GND_2]
MOTOR_VDD_2: Q1_2.5(D) Q1_2.6(D) Q1_2.7(D) Q1_2.8(D) Q2_2.5(D) Q2_2.6(D) Q2_2.7(D) Q2_2.8(D) Q3_2.5(D) Q3_2.6(D) Q3_2.7(D) Q3_2.8(D) U1_2.4(GVDD) ; port VDD  [project net VBAT]
G1_H_2: Q3_2.4(G) U1_2.19(GHA)
G1_L_2: Q4_2.4(G) U1_2.11(GLA)
G2_H_2: Q1_2.4(G) U1_2.16(GHB)
G2_L_2: Q5_2.4(G) U1_2.10(GLB)
G3_H_2: Q2_2.4(G) U1_2.13(GHC)
G3_L_2: Q6_2.4(G) U1_2.9(GLC)
OUT1_2: C1_2.2 Q3_2.1(S) Q3_2.2(S) Q3_2.3(S) Q4_2.5(D) Q4_2.6(D) Q4_2.7(D) Q4_2.8(D) R5_2.2 U1_2.18(SHA)
OUT2_2: C2_2.2 Q1_2.1(S) Q1_2.2(S) Q1_2.3(S) Q5_2.5(D) Q5_2.6(D) Q5_2.7(D) Q5_2.8(D) R7_2.2 U1_2.15(SHB)
OUT3_2: C3_2.2 Q2_2.1(S) Q2_2.2(S) Q2_2.3(S) Q6_2.5(D) Q6_2.6(D) Q6_2.7(D) Q6_2.8(D) R9_2.2 U1_2.12(SHC)
SNS_U_2: R4_2.2 R5_2.1 R10_2.2
SNS_V_2: R6_2.2 R7_2.1 R11_2.2
SNS_W_2: R8_2.2 R9_2.1 R12_2.2
SNS_X_2: R4_2.1 R6_2.1 R8_2.1
NetC1_2_1: C1_2.1 U1_2.20(BSTA)
NetC2_2_1: C2_2.1 U1_2.17(BSTB)
NetC3_2_1: C3_2.1 U1_2.14(BSTC)
NetQ4_2_1: Q4_2.1(S) Q4_2.2(S) Q4_2.3(S) R1_2.2
NetQ5_2_1: Q5_2.1(S) Q5_2.2(S) Q5_2.3(S) R2_2.2
NetQ6_2_1: Q6_2.1(S) Q6_2.2(S) Q6_2.3(S) R3_2.2
NetU1_2_1: U1_2.1(INLA) ; port INLA
NetU1_2_2: U1_2.2(INLB) ; port INLB
NetU1_2_3: U1_2.3(INLC) ; port INLC
NetU1_2_22: U1_2.22(INHA) ; port INHA
NetU1_2_23: U1_2.23(INHB) ; port INHB
NetU1_2_24: U1_2.24(INHC) ; port INHC

Not connected (* = marked no-connect by the designer): U1_2 5(MODE) 21(DT)

### Library data of the parts
C1_2 C2_2 C3_2 = C0402C104K4RACAUTO: as C1_1 on sheet Motor1; Part Number: C0402C104K4RACAUTO; Value: 0.1 µF; Applications: Automotive, Bypass, Decoupling; Capacitance: 0.1 µF; componentlink1description: Datasheet; componentlink1url: https://api.kemet.com/component-edge/download/specsheet/C0402C104K4RACAUTO.pdf; componentlink2description: DigiKey Link; componentlink2url: https://www.digikey.com/en/products/detail/kemet/C0402C104K4RACAUTO/3314827; Device Package: 0402 (1005 Metric); lastupdated: 8/14/2022 9:05:51 PM; Lifecycle Status: Active; Minimum Order: 1; Mounting Type: Surface Mount, MLCC; Operating Temperature: -55°C ~ 125°C; Package / Case: 0402 (1005 Metric); packaging: TapeAndReel; partid: 3024; Part Status: Active; price: 0.01; Ratings: AEC-Q200; series: SMD Auto X7R; Size / Dimension: 0.039" L x 0.020" W (1.00mm x 0.50mm); Supplier 1: DigiKey; Supplier Part Number 1: 399-6828-1-ND; Temperature Coefficient: X7R; Thickness (Max): 0.022" (0.55mm); Voltage - Rated: 16V
Q1_2 Q2_2 Q3_2 Q4_2 Q5_2 Q6_2 = NVTFS5C680NL: N-FET
R1_2 R2_2 R3_2 = ERJ-3BWFR020V: as R1_1 on sheet Motor1; Part Number: ERJ-3BWFR020V; Package / Case: 0603 (1608 Metric); ComponentLink1Description: Datasheet; ComponentLink1URL: https://industrial.panasonic.com/cdbs/www-data/pdf/RDN0000/AOA0000C313.pdf; ComponentLink2Description: DigiKey Link; ComponentLink2URL: https://www.digikey.com/en/products/detail/panasonic-electronic-components/ERJ-3BWFR020V/5647494; Composition: Thick Film; Device Package: 0603 (1608 Metric); Features: Automotive AEC-Q200, Current Sense; Height - Seated (Max): 0.026" (0.65mm); LastUpdated: 8/14/2022 9:50:04 PM; Lifecycle Status: Active; Minimum Order: 1; Number of Terminations: 2; Operating Temperature: -55°C ~ 155°C; Packaging: TapeAndReel; PartId: 64; Part Status: Active; Price: 0.06; Ratings: AEC-Q200; Resistance: 20 mOhms; Series: ERJ-3BW; Size / Dimension: 0.063" L x 0.031" W (1.60mm x 0.80mm); Supplier 1: DigiKey; Supplier Part Number 1: P17461CT-ND; Supplier Device Package: 0603; Tolerance: ±1%; Value: 20 mOhms
R4_2 R5_2 R6_2 R7_2 R8_2 R9_2 R10_2 R11_2 R12_2 = RK73H1ETTP1432F: as R4_1 on sheet Motor1; Part Number: RK73H1ETTP1432F; Value: 1 kOhms; ComponentLink1Description: Datasheet; ComponentLink1URL: http://www.koaspeer.com/catimages/Products/RK73H/RK73H.pdf; ComponentLink2Description: DigiKey Link; ComponentLink2URL: https://www.digikey.com/en/products/detail/koa-speer-electronics-inc/RK73H1ETTP1432F/9844351; Composition: Thick Film; Device Package: 0402 (1005 Metric); Features: Automotive AEC-Q200, Moisture Resistant; Height - Seated (Max): 0.016" (0.40mm); LastUpdated: 8/14/2022 9:23:49 PM; Lifecycle Status: Active; Minimum Order: 1; Number of Terminations: 2; Operating Temperature: -55°C ~ 155°C; Package / Case: 0402 (1005 Metric); Packaging: CutTape; PartId: 10193; Part Status: Active; Price: 0.01; Ratings: AEC-Q200; Series: RK73H; Size / Dimension: 0.039" L x 0.020" W (1.00mm x 0.50mm); Supplier 1: DigiKey; Supplier Part Number 1: 2019-RK73H1ETTP1432FCT-ND; Supplier Device Package: 0402; Tolerance: ±1%
U1_2 = FD6288Q: as U1_1 on sheet Motor1; Texas_Instruments-Purchase-URL: https://snapeda.com/shop?store=Texas+Instruments&id=3625400; Price: None; Availability: Warning; Package: VSON-10 Texas Instruments; SnapEDA_Link: https://www.snapeda.com/parts/UCC27282DRCR/Texas%20Instruments/view-part/3625400/?ref=snap; DigiKey-Purchase-URL: https://snapeda.com/shop?store=DigiKey&id=3625400; Value: *

## Sheet Motor3.SchDoc
size A; SheetNumber: 6; SheetTotal: 7
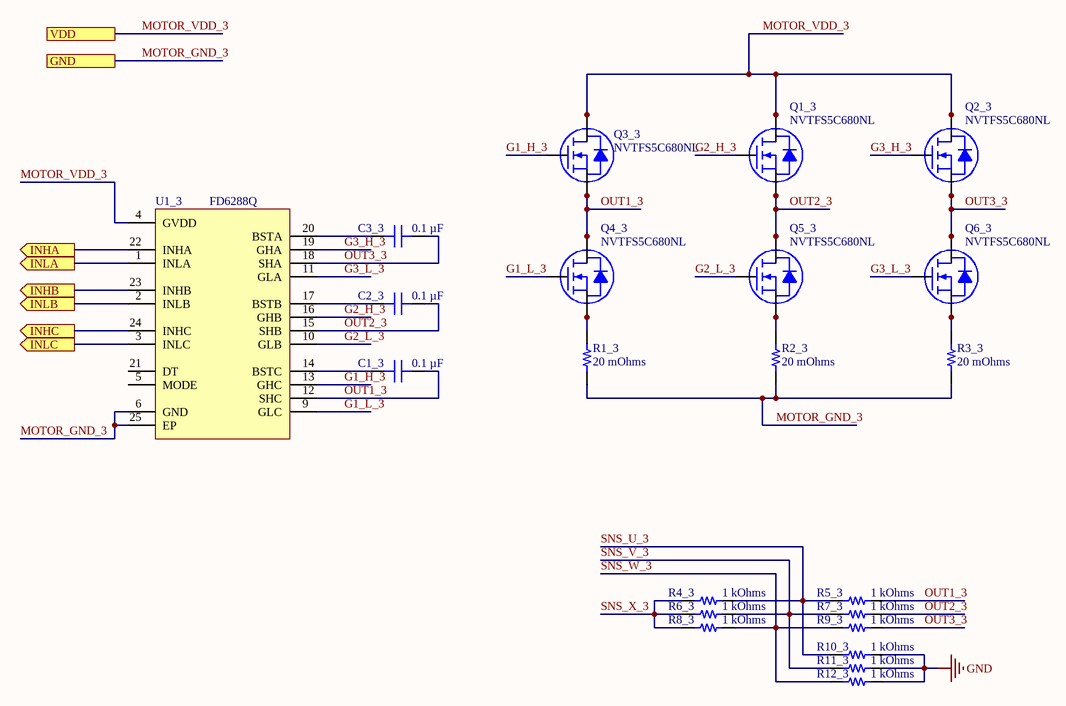
[diagram p5: Motor3.SchDoc]

### Parts
C1_3  0.1 µF  [CAP 0402_1005]
C2_3  0.1 µF  [CAP 0402_1005]
C3_3  0.1 µF  [CAP 0402_1005]
Q1_3  NVTFS5C680NL  [NVTFS015N04CTAG]
Q2_3  NVTFS5C680NL  [NVTFS015N04CTAG]
Q3_3  NVTFS5C680NL  [NVTFS015N04CTAG]
Q4_3  NVTFS5C680NL  [NVTFS015N04CTAG]
Q5_3  NVTFS5C680NL  [NVTFS015N04CTAG]
Q6_3  NVTFS5C680NL  [NVTFS015N04CTAG]
R1_3  20 mOhms  [STACKPOLE CSR0805]
R2_3  20 mOhms  [STACKPOLE CSR0805]
R3_3  20 mOhms  [STACKPOLE CSR0805]
R4_3  1 kOhms  [RES 0402_1005]
R5_3  1 kOhms  [RES 0402_1005]
R6_3  1 kOhms  [RES 0402_1005]
R7_3  1 kOhms  [RES 0402_1005]
R8_3  1 kOhms  [RES 0402_1005]
R9_3  1 kOhms  [RES 0402_1005]
R10_3  1 kOhms  [RES 0402_1005]
R11_3  1 kOhms  [RES 0402_1005]
R12_3  1 kOhms  [RES 0402_1005]
U1_3  FD6288Q  [QFN50P400X400X100-25N]

### Ports
GND, INHA (out), INHB (out), INHC (out), INLA (out), INLB (out), INLC (out), VDD

### Nets
GND: R1_3.1 R2_3.1 R3_3.1 R10_3.1 R11_3.1 R12_3.1 U1_3.6(GND) U1_3.25(EP) ; port GND  [also labelled MOTOR_GND_3]
MOTOR_VDD_3: Q1_3.5(D) Q1_3.6(D) Q1_3.7(D) Q1_3.8(D) Q2_3.5(D) Q2_3.6(D) Q2_3.7(D) Q2_3.8(D) Q3_3.5(D) Q3_3.6(D) Q3_3.7(D) Q3_3.8(D) U1_3.4(GVDD) ; port VDD  [project net VBAT]
G1_H_3: Q3_3.4(G) U1_3.13(GHC)
G1_L_3: Q4_3.4(G) U1_3.9(GLC)
G2_H_3: Q1_3.4(G) U1_3.16(GHB)
G2_L_3: Q5_3.4(G) U1_3.10(GLB)
G3_H_3: Q2_3.4(G) U1_3.19(GHA)
G3_L_3: Q6_3.4(G) U1_3.11(GLA)
OUT1_3: C1_3.2 Q3_3.1(S) Q3_3.2(S) Q3_3.3(S) Q4_3.5(D) Q4_3.6(D) Q4_3.7(D) Q4_3.8(D) R5_3.2 U1_3.12(SHC)
OUT2_3: C2_3.2 Q1_3.1(S) Q1_3.2(S) Q1_3.3(S) Q5_3.5(D) Q5_3.6(D) Q5_3.7(D) Q5_3.8(D) R7_3.2 U1_3.15(SHB)
OUT3_3: C3_3.2 Q2_3.1(S) Q2_3.2(S) Q2_3.3(S) Q6_3.5(D) Q6_3.6(D) Q6_3.7(D) Q6_3.8(D) R9_3.2 U1_3.18(SHA)
SNS_U_3: R4_3.2 R5_3.1 R10_3.2
SNS_V_3: R6_3.2 R7_3.1 R11_3.2
SNS_W_3: R8_3.2 R9_3.1 R12_3.2
SNS_X_3: R4_3.1 R6_3.1 R8_3.1
NetC1_3_1: C1_3.1 U1_3.14(BSTC)
NetC2_3_1: C2_3.1 U1_3.17(BSTB)
NetC3_3_1: C3_3.1 U1_3.20(BSTA)
NetQ4_3_1: Q4_3.1(S) Q4_3.2(S) Q4_3.3(S) R1_3.2
NetQ5_3_1: Q5_3.1(S) Q5_3.2(S) Q5_3.3(S) R2_3.2
NetQ6_3_1: Q6_3.1(S) Q6_3.2(S) Q6_3.3(S) R3_3.2
NetU1_3_1: U1_3.1(INLA) ; port INLA
NetU1_3_2: U1_3.2(INLB) ; port INLB
NetU1_3_3: U1_3.3(INLC) ; port INLC
NetU1_3_22: U1_3.22(INHA) ; port INHA
NetU1_3_23: U1_3.23(INHB) ; port INHB
NetU1_3_24: U1_3.24(INHC) ; port INHC

Not connected (* = marked no-connect by the designer): U1_3 5(MODE) 21(DT)

### Library data of the parts
C1_3 C2_3 C3_3 = C0402C104K4RACAUTO: as C1_1 on sheet Motor1; Part Number: C0402C104K4RACAUTO; Value: 0.1 µF; Applications: Automotive, Bypass, Decoupling; Capacitance: 0.1 µF; componentlink1description: Datasheet; componentlink1url: https://api.kemet.com/component-edge/download/specsheet/C0402C104K4RACAUTO.pdf; componentlink2description: DigiKey Link; componentlink2url: https://www.digikey.com/en/products/detail/kemet/C0402C104K4RACAUTO/3314827; Device Package: 0402 (1005 Metric); lastupdated: 8/14/2022 9:05:51 PM; Lifecycle Status: Active; Minimum Order: 1; Mounting Type: Surface Mount, MLCC; Operating Temperature: -55°C ~ 125°C; Package / Case: 0402 (1005 Metric); packaging: TapeAndReel; partid: 3024; Part Status: Active; price: 0.01; Ratings: AEC-Q200; series: SMD Auto X7R; Size / Dimension: 0.039" L x 0.020" W (1.00mm x 0.50mm); Supplier 1: DigiKey; Supplier Part Number 1: 399-6828-1-ND; Temperature Coefficient: X7R; Thickness (Max): 0.022" (0.55mm); Voltage - Rated: 16V
Q1_3 Q2_3 Q3_3 Q4_3 Q5_3 Q6_3 = NVTFS5C680NL: N-FET
R1_3 R2_3 R3_3 = ERJ-3BWFR020V: as R1_1 on sheet Motor1; Part Number: ERJ-3BWFR020V; Package / Case: 0603 (1608 Metric); ComponentLink1Description: Datasheet; ComponentLink1URL: https://industrial.panasonic.com/cdbs/www-data/pdf/RDN0000/AOA0000C313.pdf; ComponentLink2Description: DigiKey Link; ComponentLink2URL: https://www.digikey.com/en/products/detail/panasonic-electronic-components/ERJ-3BWFR020V/5647494; Composition: Thick Film; Device Package: 0603 (1608 Metric); Features: Automotive AEC-Q200, Current Sense; Height - Seated (Max): 0.026" (0.65mm); LastUpdated: 8/14/2022 9:50:04 PM; Lifecycle Status: Active; Minimum Order: 1; Number of Terminations: 2; Operating Temperature: -55°C ~ 155°C; Packaging: TapeAndReel; PartId: 64; Part Status: Active; Price: 0.06; Ratings: AEC-Q200; Resistance: 20 mOhms; Series: ERJ-3BW; Size / Dimension: 0.063" L x 0.031" W (1.60mm x 0.80mm); Supplier 1: DigiKey; Supplier Part Number 1: P17461CT-ND; Supplier Device Package: 0603; Tolerance: ±1%; Value: 20 mOhms
R4_3 R5_3 R6_3 R7_3 R8_3 R9_3 R10_3 R11_3 R12_3 = RK73H1ETTP1432F: as R4_1 on sheet Motor1; Part Number: RK73H1ETTP1432F; Value: 1 kOhms; ComponentLink1Description: Datasheet; ComponentLink1URL: http://www.koaspeer.com/catimages/Products/RK73H/RK73H.pdf; ComponentLink2Description: DigiKey Link; ComponentLink2URL: https://www.digikey.com/en/products/detail/koa-speer-electronics-inc/RK73H1ETTP1432F/9844351; Composition: Thick Film; Device Package: 0402 (1005 Metric); Features: Automotive AEC-Q200, Moisture Resistant; Height - Seated (Max): 0.016" (0.40mm); LastUpdated: 8/14/2022 9:23:49 PM; Lifecycle Status: Active; Minimum Order: 1; Number of Terminations: 2; Operating Temperature: -55°C ~ 155°C; Package / Case: 0402 (1005 Metric); Packaging: CutTape; PartId: 10193; Part Status: Active; Price: 0.01; Ratings: AEC-Q200; Series: RK73H; Size / Dimension: 0.039" L x 0.020" W (1.00mm x 0.50mm); Supplier 1: DigiKey; Supplier Part Number 1: 2019-RK73H1ETTP1432FCT-ND; Supplier Device Package: 0402; Tolerance: ±1%
U1_3 = FD6288Q: as U1_1 on sheet Motor1; Texas_Instruments-Purchase-URL: https://snapeda.com/shop?store=Texas+Instruments&id=3625400; Price: None; Availability: Warning; Package: VSON-10 Texas Instruments; SnapEDA_Link: https://www.snapeda.com/parts/UCC27282DRCR/Texas%20Instruments/view-part/3625400/?ref=snap; DigiKey-Purchase-URL: https://snapeda.com/shop?store=DigiKey&id=3625400; Value: *

## Sheet Motor4.SchDoc
size A; SheetNumber: 7; SheetTotal: 8
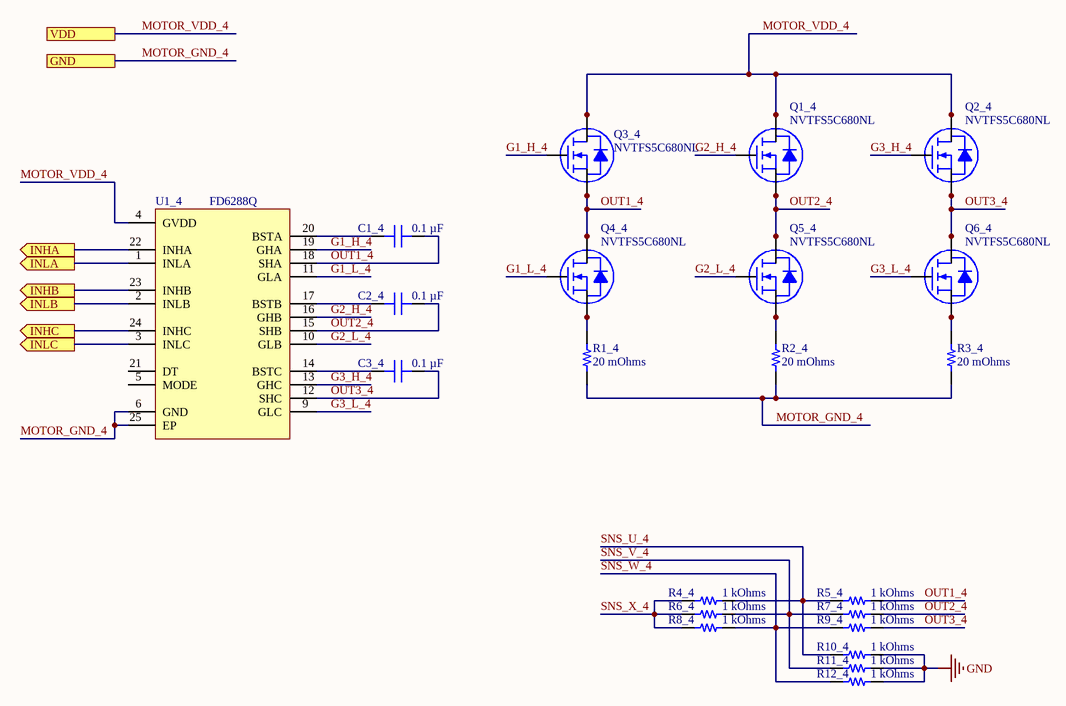
[diagram p6: Motor4.SchDoc]

### Parts
C1_4  0.1 µF  [CAP 0402_1005]
C2_4  0.1 µF  [CAP 0402_1005]
C3_4  0.1 µF  [CAP 0402_1005]
Q1_4  NVTFS5C680NL  [NVTFS015N04CTAG]
Q2_4  NVTFS5C680NL  [NVTFS015N04CTAG]
Q3_4  NVTFS5C680NL  [NVTFS015N04CTAG]
Q4_4  NVTFS5C680NL  [NVTFS015N04CTAG]
Q5_4  NVTFS5C680NL  [NVTFS015N04CTAG]
Q6_4  NVTFS5C680NL  [NVTFS015N04CTAG]
R1_4  20 mOhms  [STACKPOLE CSR0805]
R2_4  20 mOhms  [STACKPOLE CSR0805]
R3_4  20 mOhms  [STACKPOLE CSR0805]
R4_4  1 kOhms  [RES 0402_1005]
R5_4  1 kOhms  [RES 0402_1005]
R6_4  1 kOhms  [RES 0402_1005]
R7_4  1 kOhms  [RES 0402_1005]
R8_4  1 kOhms  [RES 0402_1005]
R9_4  1 kOhms  [RES 0402_1005]
R10_4  1 kOhms  [RES 0402_1005]
R11_4  1 kOhms  [RES 0402_1005]
R12_4  1 kOhms  [RES 0402_1005]
U1_4  FD6288Q  [QFN50P400X400X100-25N]

### Ports
GND, INHA (out), INHB (out), INHC (out), INLA (out), INLB (out), INLC (out), VDD

### Nets
GND: R1_4.1 R2_4.1 R3_4.1 R10_4.1 R11_4.1 R12_4.1 U1_4.6(GND) U1_4.25(EP) ; port GND  [also labelled MOTOR_GND_4]
MOTOR_VDD_4: Q1_4.5(D) Q1_4.6(D) Q1_4.7(D) Q1_4.8(D) Q2_4.5(D) Q2_4.6(D) Q2_4.7(D) Q2_4.8(D) Q3_4.5(D) Q3_4.6(D) Q3_4.7(D) Q3_4.8(D) U1_4.4(GVDD) ; port VDD  [project net VBAT]
G1_H_4: Q3_4.4(G) U1_4.19(GHA)
G1_L_4: Q4_4.4(G) U1_4.11(GLA)
G2_H_4: Q1_4.4(G) U1_4.16(GHB)
G2_L_4: Q5_4.4(G) U1_4.10(GLB)
G3_H_4: Q2_4.4(G) U1_4.13(GHC)
G3_L_4: Q6_4.4(G) U1_4.9(GLC)
OUT1_4: C1_4.2 Q3_4.1(S) Q3_4.2(S) Q3_4.3(S) Q4_4.5(D) Q4_4.6(D) Q4_4.7(D) Q4_4.8(D) R5_4.2 U1_4.18(SHA)
OUT2_4: C2_4.2 Q1_4.1(S) Q1_4.2(S) Q1_4.3(S) Q5_4.5(D) Q5_4.6(D) Q5_4.7(D) Q5_4.8(D) R7_4.2 U1_4.15(SHB)
OUT3_4: C3_4.2 Q2_4.1(S) Q2_4.2(S) Q2_4.3(S) Q6_4.5(D) Q6_4.6(D) Q6_4.7(D) Q6_4.8(D) R9_4.2 U1_4.12(SHC)
SNS_U_4: R4_4.2 R5_4.1 R10_4.2
SNS_V_4: R6_4.2 R7_4.1 R11_4.2
SNS_W_4: R8_4.2 R9_4.1 R12_4.2
SNS_X_4: R4_4.1 R6_4.1 R8_4.1
NetC1_4_1: C1_4.1 U1_4.20(BSTA)
NetC2_4_1: C2_4.1 U1_4.17(BSTB)
NetC3_4_1: C3_4.1 U1_4.14(BSTC)
NetQ4_4_1: Q4_4.1(S) Q4_4.2(S) Q4_4.3(S) R1_4.2
NetQ5_4_1: Q5_4.1(S) Q5_4.2(S) Q5_4.3(S) R2_4.2
NetQ6_4_1: Q6_4.1(S) Q6_4.2(S) Q6_4.3(S) R3_4.2
NetU1_4_1: U1_4.1(INLA) ; port INLA
NetU1_4_2: U1_4.2(INLB) ; port INLB
NetU1_4_3: U1_4.3(INLC) ; port INLC
NetU1_4_22: U1_4.22(INHA) ; port INHA
NetU1_4_23: U1_4.23(INHB) ; port INHB
NetU1_4_24: U1_4.24(INHC) ; port INHC

Not connected (* = marked no-connect by the designer): U1_4 5(MODE) 21(DT)

### Library data of the parts
C1_4 C2_4 C3_4 = C0402C104K4RACAUTO: as C1_1 on sheet Motor1; Part Number: C0402C104K4RACAUTO; Value: 0.1 µF; Applications: Automotive, Bypass, Decoupling; Capacitance: 0.1 µF; componentlink1description: Datasheet; componentlink1url: https://api.kemet.com/component-edge/download/specsheet/C0402C104K4RACAUTO.pdf; componentlink2description: DigiKey Link; componentlink2url: https://www.digikey.com/en/products/detail/kemet/C0402C104K4RACAUTO/3314827; Device Package: 0402 (1005 Metric); lastupdated: 8/14/2022 9:05:51 PM; Lifecycle Status: Active; Minimum Order: 1; Mounting Type: Surface Mount, MLCC; Operating Temperature: -55°C ~ 125°C; Package / Case: 0402 (1005 Metric); packaging: TapeAndReel; partid: 3024; Part Status: Active; price: 0.01; Ratings: AEC-Q200; series: SMD Auto X7R; Size / Dimension: 0.039" L x 0.020" W (1.00mm x 0.50mm); Supplier 1: DigiKey; Supplier Part Number 1: 399-6828-1-ND; Temperature Coefficient: X7R; Thickness (Max): 0.022" (0.55mm); Voltage - Rated: 16V
Q1_4 Q2_4 Q3_4 Q4_4 Q5_4 Q6_4 = NVTFS5C680NL: N-FET
R1_4 R2_4 R3_4 = ERJ-3BWFR020V: as R1_1 on sheet Motor1; Part Number: ERJ-3BWFR020V; Package / Case: 0603 (1608 Metric); ComponentLink1Description: Datasheet; ComponentLink1URL: https://industrial.panasonic.com/cdbs/www-data/pdf/RDN0000/AOA0000C313.pdf; ComponentLink2Description: DigiKey Link; ComponentLink2URL: https://www.digikey.com/en/products/detail/panasonic-electronic-components/ERJ-3BWFR020V/5647494; Composition: Thick Film; Device Package: 0603 (1608 Metric); Features: Automotive AEC-Q200, Current Sense; Height - Seated (Max): 0.026" (0.65mm); LastUpdated: 8/14/2022 9:50:04 PM; Lifecycle Status: Active; Minimum Order: 1; Number of Terminations: 2; Operating Temperature: -55°C ~ 155°C; Packaging: TapeAndReel; PartId: 64; Part Status: Active; Price: 0.06; Ratings: AEC-Q200; Resistance: 20 mOhms; Series: ERJ-3BW; Size / Dimension: 0.063" L x 0.031" W (1.60mm x 0.80mm); Supplier 1: DigiKey; Supplier Part Number 1: P17461CT-ND; Supplier Device Package: 0603; Tolerance: ±1%; Value: 20 mOhms
R4_4 R5_4 R6_4 R7_4 R8_4 R9_4 R10_4 R11_4 R12_4 = RK73H1ETTP1432F: as R4_1 on sheet Motor1; Part Number: RK73H1ETTP1432F; Value: 1 kOhms; ComponentLink1Description: Datasheet; ComponentLink1URL: http://www.koaspeer.com/catimages/Products/RK73H/RK73H.pdf; ComponentLink2Description: DigiKey Link; ComponentLink2URL: https://www.digikey.com/en/products/detail/koa-speer-electronics-inc/RK73H1ETTP1432F/9844351; Composition: Thick Film; Device Package: 0402 (1005 Metric); Features: Automotive AEC-Q200, Moisture Resistant; Height - Seated (Max): 0.016" (0.40mm); LastUpdated: 8/14/2022 9:23:49 PM; Lifecycle Status: Active; Minimum Order: 1; Number of Terminations: 2; Operating Temperature: -55°C ~ 155°C; Package / Case: 0402 (1005 Metric); Packaging: CutTape; PartId: 10193; Part Status: Active; Price: 0.01; Ratings: AEC-Q200; Series: RK73H; Size / Dimension: 0.039" L x 0.020" W (1.00mm x 0.50mm); Supplier 1: DigiKey; Supplier Part Number 1: 2019-RK73H1ETTP1432FCT-ND; Supplier Device Package: 0402; Tolerance: ±1%
U1_4 = FD6288Q: as U1_1 on sheet Motor1; Texas_Instruments-Purchase-URL: https://snapeda.com/shop?store=Texas+Instruments&id=3625400; Price: None; Availability: Warning; Package: VSON-10 Texas Instruments; SnapEDA_Link: https://www.snapeda.com/parts/UCC27282DRCR/Texas%20Instruments/view-part/3625400/?ref=snap; DigiKey-Purchase-URL: https://snapeda.com/shop?store=DigiKey&id=3625400; Value: *

## Sheet STM32.SchDoc
size A; SheetNumber: 8; SheetTotal: 8
Used 4 times, as channels U_STM321, U_STM322, U_STM323, U_STM324. Parts and nets are listed once, with the designators drawn on the sheet.
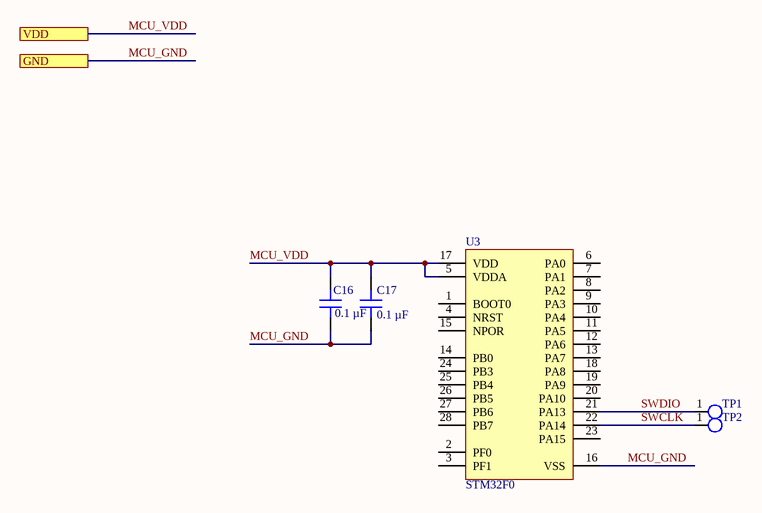
[diagram p7: STM32.SchDoc]

### Parts
C16  0.1 µF  [CAP 0402_1005]
C17  0.1 µF  [CAP 0402_1005]
TP1  0.635mm  [TP  0.635mm]  (value not drawn)
TP2  0.635mm  [TP  0.635mm]  (value not drawn)
U3  STM32F0  [QFN50P400X400X60-28N]

### Ports
GND, VDD

### Nets
MCU_GND: C16.1 C17.1 U3.16(VSS) ; port GND
MCU_VDD: C16.2 C17.2 U3.5(VDDA) U3.17(VDD) ; port VDD
SWCLK: TP2.1(TP) U3.22(PA14)
SWDIO: TP1.1(TP) U3.21(PA13)

Not connected (* = marked no-connect by the designer): U3 1(BOOT0) 2(PF0) 3(PF1) 4(NRST) 6(PA0) 7(PA1) 8(PA2) 9(PA3) 10(PA4) 11(PA5) 12(PA6) 13(PA7) 14(PB0) 15(NPOR) 18(PA8) 19(PA9) 20(PA10) 23(PA15) 24(PB3) 25(PB4) 26(PB5) 27(PB6) 28(PB7)

### Channels
U_STM321: designators end in _1; ports GND=GND VDD=3V3
U_STM322: designators end in _2; ports GND=GND VDD=3V3
U_STM323: designators end in _3; ports GND=GND VDD=3V3
U_STM324: designators end in _4; ports GND=GND VDD=3V3

### Library data of the parts
C16 C17 = C0402C104K4RACAUTO: as C1_1 on sheet Motor1; Part Number: C0402C104K4RACAUTO; Value: 0.1 µF; Applications: Automotive, Bypass, Decoupling; Capacitance: 0.1 µF; componentlink1description: Datasheet; componentlink1url: https://api.kemet.com/component-edge/download/specsheet/C0402C104K4RACAUTO.pdf; componentlink2description: DigiKey Link; componentlink2url: https://www.digikey.com/en/products/detail/kemet/C0402C104K4RACAUTO/3314827; Device Package: 0402 (1005 Metric); lastupdated: 8/14/2022 9:05:51 PM; Lifecycle Status: Active; Minimum Order: 1; Mounting Type: Surface Mount, MLCC; Operating Temperature: -55°C ~ 125°C; Package / Case: 0402 (1005 Metric); packaging: TapeAndReel; partid: 3024; Part Status: Active; price: 0.01; Ratings: AEC-Q200; series: SMD Auto X7R; Size / Dimension: 0.039" L x 0.020" W (1.00mm x 0.50mm); Supplier 1: DigiKey; Supplier Part Number 1: 399-6828-1-ND; Temperature Coefficient: X7R; Thickness (Max): 0.022" (0.55mm); Voltage - Rated: 16V
TP1 TP2 = TP 0.635mm: Test point
U3 = STM32F0: 6-DOF IMU

## Nets that join several sheets
3V3: 3V3_LDO (C8.1 C9.2 U1.5), U_STM321 (C16_1.2 C17_1.2 U3_1.5 U3_1.17), U_STM322 (C16_2.2 C17_2.2 U3_2.5 U3_2.17), U_STM323 (C16_3.2 C17_3.2 U3_3.5 U3_3.17), U_STM324 (C16_4.2 C17_4.2 U3_4.5 U3_4.17)
5V: Top (R1.1), 5V_buck (5 pins), 3V3_LDO (C6.2 C7.1 R2.2 U1.1)
GND: Top (9 pins), 5V_buck (6 pins), 3V3_LDO (5 pins), Motor1 (8 pins), Motor2 (8 pins), Motor3 (8 pins), Motor4 (8 pins), U_STM321 (C16_1.1 C17_1.1 U3_1.16), U_STM322 (C16_2.1 C17_2.1 U3_2.16), U_STM323 (C16_3.1 C17_3.1 U3_3.16), U_STM324 (C16_4.1 C17_4.1 U3_4.16)
VBAT: Top (8 pins), 5V_buck (C14.2 C15.1 R4.2 U2.3), Motor1 (13 pins), Motor2 (13 pins), Motor3 (13 pins), Motor4 (13 pins)

## Assembly variants
Main: all parts fitted